# EAGLE design ESP_LoRa_1.2 (EAGLE 9.6.2)
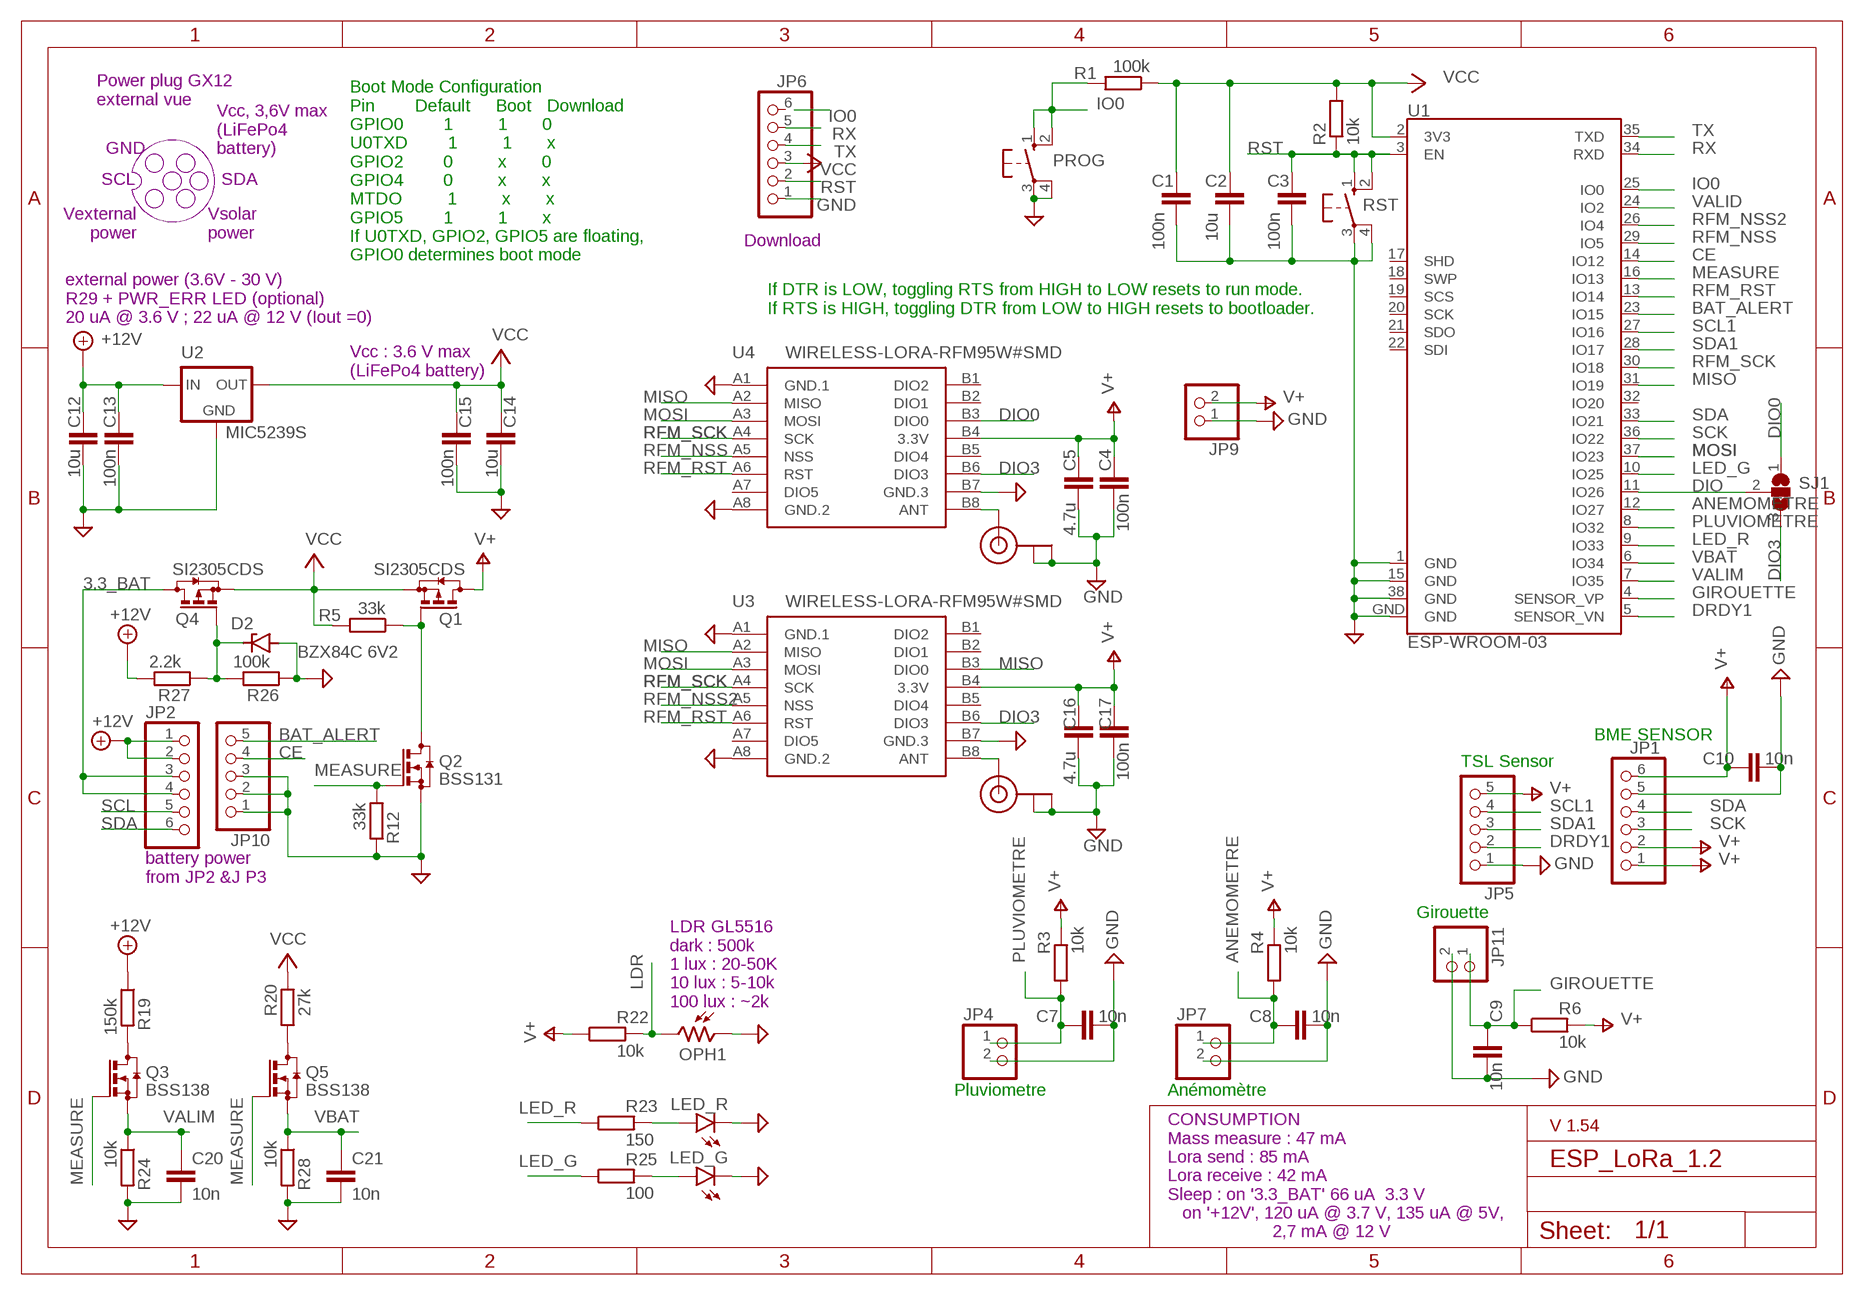
[diagram p0: schematic, sheet 1]

## Parts
C1  100n  CC1206  [C1206]
C2  10u  CC1210  [C1210]
C3  100n  CC1206  [C1206]
C4  100n  CC1206  [C1206]
C5  4.7u  CC1210  [C1210]
C7  10n  CC1206  [C1206]
C8  10n  CC1206  [C1206]
C9  10n  CC1206  [C1206]
C10  10n  CC1206  [C1206]
C12  10u  CC1210  [C1210]
C13  100n  CC1206  [C1206]
C14  10u  CC1210  [C1210]
C15  100n  CC1206  [C1206]
C16  4.7u  CC1210  [C1210]
C17  100n  CC1206  [C1206]
C20  10n  CC1206  [C1206]
C21  10n  CC1206  [C1206]
D2  BZX84C 6V2  BZX84CSMD  [TO236]
J1  U.FL  [U.FL]
J2  U.FL  [U.FL]
JP1  PINHD-1X6  [1X06]
JP2  PINHD-1X6  [1X06]
JP4  PINHD-1X2  [1X02]
JP5  PINHD-1X5  [1X05]
JP6  PINHD-1X6  [1X06]
JP7  PINHD-1X2  [1X02]
JP9  PINHD-1X2  [1X02]
JP10  PINHD-1X5  [1X05]
JP11  PINHD-1X2  [1X02]
LED_G  LEDSMT1206  [1206]
LED_R  LEDSMT1206  [1206]
OPH1  VT93N2  [VT900]
PROG  10-XX  [B3F-10XX]
Q1  SI2305CDS  [SOT23]
Q2  BSS131  [SOT23]
Q3  BSS138  [SOT23]
Q4  SI2305CDS  [SOT23]
Q5  BSS138  [SOT23]
R1  100k  RR1206  [R1206]
R2  10k  RR1206  [R1206]
R3  10k  RR1206  [R1206]
R4  10k  RR1206  [R1206]
R5  33k  RR1206  [R1206]
R6  10k  RR1206  [R1206]
R12  33k  RR1206  [R1206]
R19  150k  RR1206  [R1206]
R20  27k  RR1206  [R1206]
R22  10k  RR1206  [R1206]
R23  150  RR1206  [R1206]
R24  10k  RR1206  [R1206]
R25  100  RR1206  [R1206]
R26  100k  RR1206  [R1206]
R27  2.2k  RR1206  [R1206]
R28  10k  RR1206  [R1206]
RST  10-XX  [B3F-10XX]
SJ1  SJ2W  [SJ_2]
U1  ESP-WROOM-03  [ESP-WROOM-03]
U2  MIC5239S  [SOT223]
U3  WIRELESS-LORA-RFM95W#SMD  [WIRELESS-LORA-RFM95W#SMD]
U4  WIRELESS-LORA-RFM95W#SMD  [WIRELESS-LORA-RFM95W#SMD]

## Nets
3.3_BAT: JP2.3 JP2.4 Q4.3(D)
+12V: C12.1 C13.1 JP2.1 JP2.2 R19.1 R27.2 U2.1(IN)
ANEMOMETRE: C8.1 JP7.1 R4.1 U1.12(IO27)
ANT2: J2.3(SIGNAL) U4.B8(ANT)
ANT3: J1.3(SIGNAL) U3.B8(ANT)
BAT_ALERT: JP10.5 U1.23(IO15)
CE: JP10.4 U1.14(IO12)
DIO: SJ1.2 U1.11(IO26)
DIO0: SJ1.1 U4.B3(DIO0)
DIO3: SJ1.3 U3.B6(DIO3) U4.B6(DIO3)
DRDY1: JP5.2 U1.5(SENSOR_VN)
GIROUETTE: C9.1 JP11.1 R6.1 U1.4(SENSOR_VP)
GND: C1.2 C2.2 C3.2 C4.2 C5.2 C7.2 C8.2 C9.2 C10.2 C12.2 C13.2 C14.2 C15.2 C16.2 C17.2 C20.2 C21.2 D2.A J1.1(GND) J1.2(GND) J2.1(GND) J2.2(GND) JP1.5 JP4.2 JP5.1 JP6.1 JP7.2 JP9.1 JP10.1 JP10.2 JP10.3 JP11.2 LED_G.C LED_R.C OPH1.1 PROG.3(P) PROG.4(P1) Q2.2(S) R12.2 R24.2 R26.1 R28.2 RST.3(P) RST.4(P1) U1.1(GND) U1.15(GND) U1.38(GND) U1.GND U2.2(GND) U2.4(GND) U3.A1(GND.1) U3.A8(GND.2) U3.B7(GND.3) U4.A1(GND.1) U4.A8(GND.2) U4.B7(GND.3)
IO0: PROG.1(S) PROG.2(S1) R1.2 U1.25(IO0)
LDR: OPH1.2 R22.2
LED_G: R25.1 U1.10(IO25)
LED_R: R23.1 U1.9(IO33)
MEASURE: Q2.1(G) Q3.1(G) Q5.1(G) R12.1 U1.16(IO13)
MISO: U1.31(IO19) U3.A2(MISO) U3.B3(DIO0) U4.A2(MISO)
MOSI: U1.37(IO23) U3.A3(MOSI) U4.A3(MOSI)
N$1: Q1.1(G) Q2.3(D) R5.1
N$2: Q3.3(D) R19.2
N$5: Q5.3(D) R20.1
N$7: LED_R.A R23.2
N$8: LED_G.A R25.2
N$35: D2.C Q4.1(G) R26.2 R27.1
PLUVIOMETRE: C7.1 JP4.1 R3.1 U1.8(IO32)
RFM_NSS: U1.29(IO5) U4.A5(NSS)
RFM_NSS2: U1.26(IO4) U3.A5(NSS)
RFM_RST: U1.13(IO14) U3.A6(RST) U4.A6(RST)
RFM_SCK: U1.30(IO18) U3.A4(SCK) U4.A4(SCK)
RST: C3.1 JP6.2 R2.1 RST.1(S) RST.2(S1) U1.3(EN)
RX: JP6.5 U1.34(RXD)
SCK: JP1.3 U1.36(IO22)
SCL: JP2.5
SCL1: JP5.4 U1.27(IO16)
SDA: JP1.4 JP2.6 U1.33(IO21)
SDA1: JP5.3 U1.28(IO17)
TX: JP6.4 U1.35(TXD)
V+: C4.1 C5.1 C10.1 C16.1 C17.1 JP1.1 JP1.2 JP1.6 JP5.5 JP9.2 Q1.3(D) R3.2 R4.2 R6.2 R22.1 U3.B4(3.3V) U4.B4(3.3V)
VALID: U1.24(IO2)
VALIM: C20.1 Q3.2(S) R24.1 U1.7(IO35)
VBAT: C21.1 Q5.2(S) R28.1 U1.6(IO34)
VCC: C1.1 C2.1 C14.1 C15.1 JP6.3 Q1.2(S) Q4.2(S) R1.1 R2.2 R5.2 R20.2 U1.2(3V3) U2.3(OUT)
Unconnected: JP6.6 U1.17(SHD) U1.18(SWP) U1.19(SCS) U1.20(SCK) U1.21(SDO) U1.22(SDI) U1.32(IO20) U3.A7(DIO5) U3.B1(DIO2) U3.B2(DIO1) U3.B5(DIO4) U4.A7(DIO5) U4.B1(DIO2) U4.B2(DIO1) U4.B5(DIO4)

## Notes on the sheet
- Power plug GX12
  external vue
- GND
- Vcc, 3,6V max
  (LiFePo4
  battery)
- SCL | SDA
- Download
- Vexternal
  power
- Vsolar 
  power
- Boot Mode Configuration
  Pin        Default     Boot   Download
  GPIO0        1         1       0
  U0TXD        1         1       x
  GPIO2        0         x       0
  GPIO4        0         x       x
  MTDO         1         x       x
  GPIO5        1         1       x
  If U0TXD, GPIO2, GPIO5 are floating, 
  GPIO0 determines boot mode
- If DTR is LOW, toggling RTS from HIGH to LOW resets to run mode.
  If RTS is HIGH, toggling DTR from LOW to HIGH resets to bootloader.
- external power (3.6V - 30 V)
  R29 + PWR_ERR LED (optional)
  20 uA @ 3.6 V ; 22 uA @ 12 V (Iout =0)
- Vcc : 3.6 V max 
  (LiFePo4 battery)
- BME SENSOR
- TSL Sensor
- battery power
  from JP2 &J P3
- Girouette
- LDR GL5516
  dark : 500k
  1 lux : 20-50K
  10 lux : 5-10k
  100 lux : ~2k
- Pluviometre | Anémomètre
- V 1.54
- CONSUMPTION
  Mass measure : 47 mA
  Lora send : 85 mA
  Lora receive : 42 mA
  Sleep : on '3.3_BAT' 66 uA  3.3 V
     on '+12V', 120 uA @ 3.7 V, 135 uA @ 5V,
                       2,7 mA @ 12 V

## Library data of the parts
C1-C5 C7-C10 C12-C17 C20 C21 = eagle-ltspice:C: CAPACITOR, European symbol; SPICEMODEL: NONE; SPICEPREFIX: C
D2 = diode:BZX84CSMD: Z DIODE
J1 J2 = microbuilder:U.FL: U.FL Antenna Connector
JP1 JP2 JP6 = pinhead:PINHD-1X6: PIN HEADER
JP4 JP7 JP9 JP11 = pinhead:PINHD-1X2: PIN HEADER
JP5 JP10 = pinhead:PINHD-1X5: PIN HEADER
LED_G LED_R = led:LED: LED OSRAM: - CHIPLED LG R971, LG N971, LY N971, LG Q971, LY Q971, LO R971, LY R971 LH N974, LH R974 LS Q976, LO Q976, LY Q976 LO Q996 - Hyper CHIPLED LW Q18S LB Q993, LB Q99A, LB R99A - SideLED LS A670, LO A670, LY A670, LG A670, LP A670 LB A673, LV A673, LT A673, LW A673 LH A674 LY A675 LS A676, LA A676, LO A676, LY A676, LW A676 LS A679, LY A679, LG A679 - Hyper Micro SIDELED® LS Y876, LA Y876, LO Y876, LY Y876 LT Y87S - SmartLED LW L88C, LW L88S LB L89C, LB L89S, LG L890 LS L89K, LO L89K, LY L89K LS L896, LA L896, LO L896, LY L896 - TOPLED LS T670, LO T670, LY T670, LG T670, LP T670 LSG T670, LSP T670, LSY T670, LOP T670, LYG T670 LG T671, LOG T671, LSG T671 LB T673, LV T673, LT T673, LW T673 LH T674 LS T676, LA T676, LO T676, LY T676, LB T676, LH T676, LSB T676, LW T676 LB T67C, LV T67C, LT T67C, LS T67K, LO T67K, LY T67K, LW E67C LS E67B, LA E67B, LO E67B, LY E67B, LB E67C, LV E67C, LT E67C LW T67C LS T679, LY T679, LG T679 LS T770, LO T770, LY T770, LG T770, LP T770 LB T773, LV T773, LT T773, LW T773 LH T774 LS E675, LA E675, LY E675, LS T675 LS T776, LA T776, LO T776, LY T776, LB T776 LHGB T686 LT T68C, LB T68C - Hyper Mini TOPLED® LB M676 - Mini TOPLED Santana® LG M470 LS M47K, LO M47K, LY M47K Source: http://www.osram.convergy.de LUXEON: - LUMILED® LXK2-PW12-R00, LXK2-PW12-S00, LXK2-PW14-U00, LXK2-PW14-V00 LXK2-PM12-R00, LXK2-PM12-S00, LXK2-PM14-U00 LXK2-PE12-Q00, LXK2-PE12-R00, LXK2-PE12-S00, LXK2-PE14-T00, LXK2-PE14-U00 LXK2-PB12-K00, LXK2-PB12-L00, LXK2-PB12-M00, LXK2-PB14-N00, LXK2-PB14-P00, LXK2-PB14-Q00 LXK2-PR12-L00, LXK2-PR12-M00, LXK2-PR14-Q00, LXK2-PR14-R00 LXK2-PD12-Q00, LXK2-PD12-R00, LXK2-PD12-S00 LXK2-PH12-R00, LXK2-PH12-S00 LXK2-PL12-P00, LXK2-PL12-Q00, LXK2-PL12-R00 Source: www.luxeon.com KINGBRIGHT: KA-3528ASYC Source: www.kingbright.com
OPH1 = photo-elements:VT9: Photoconductive Cell VT900 Series Source: http://optoelectronics.perkinelmer.com/content/Datasheets/DTS_vt900seriesdatasheet.pdf
PROG RST = switch-omron:10-XX: OMRON SWITCH; MPN: B3F-1000; OC_FARNELL: 176432; OC_NEWARK: 36M3542
Q1 Q4 = transistor-small-signal-perso:SI2305CDS: P-CHANNEL MOS FET
Q2 = transistor-small-signal-perso:BSS131: N-CHANNEL MOS FET
Q3 Q5 = detect:BSS138: N-CHANNEL MOS FET
R1-R6 R12 R19 R20 R22-R28 = eagle-ltspice:R: RESISTOR, European symbol; SPICEMODEL: NONE; SPICEPREFIX: R
SJ1 = jumper:SJ2W: SMD solder JUMPER
U1 = esp32-sparkfun (1):ESP-WROOM-03; OC_FARNELL: unknown
U2 = micrel:MIC5239S: LDO REGULATOR
U3 U4 = diy-modules:WIRELESS-LORA-RFM95W: 868/915 MHz LoRa Radio Transceiver Module based on SX1276 chip Click here to find device on ebay.com <http://www.ebay.com/sch/RFM95W+transceiver>

## Board
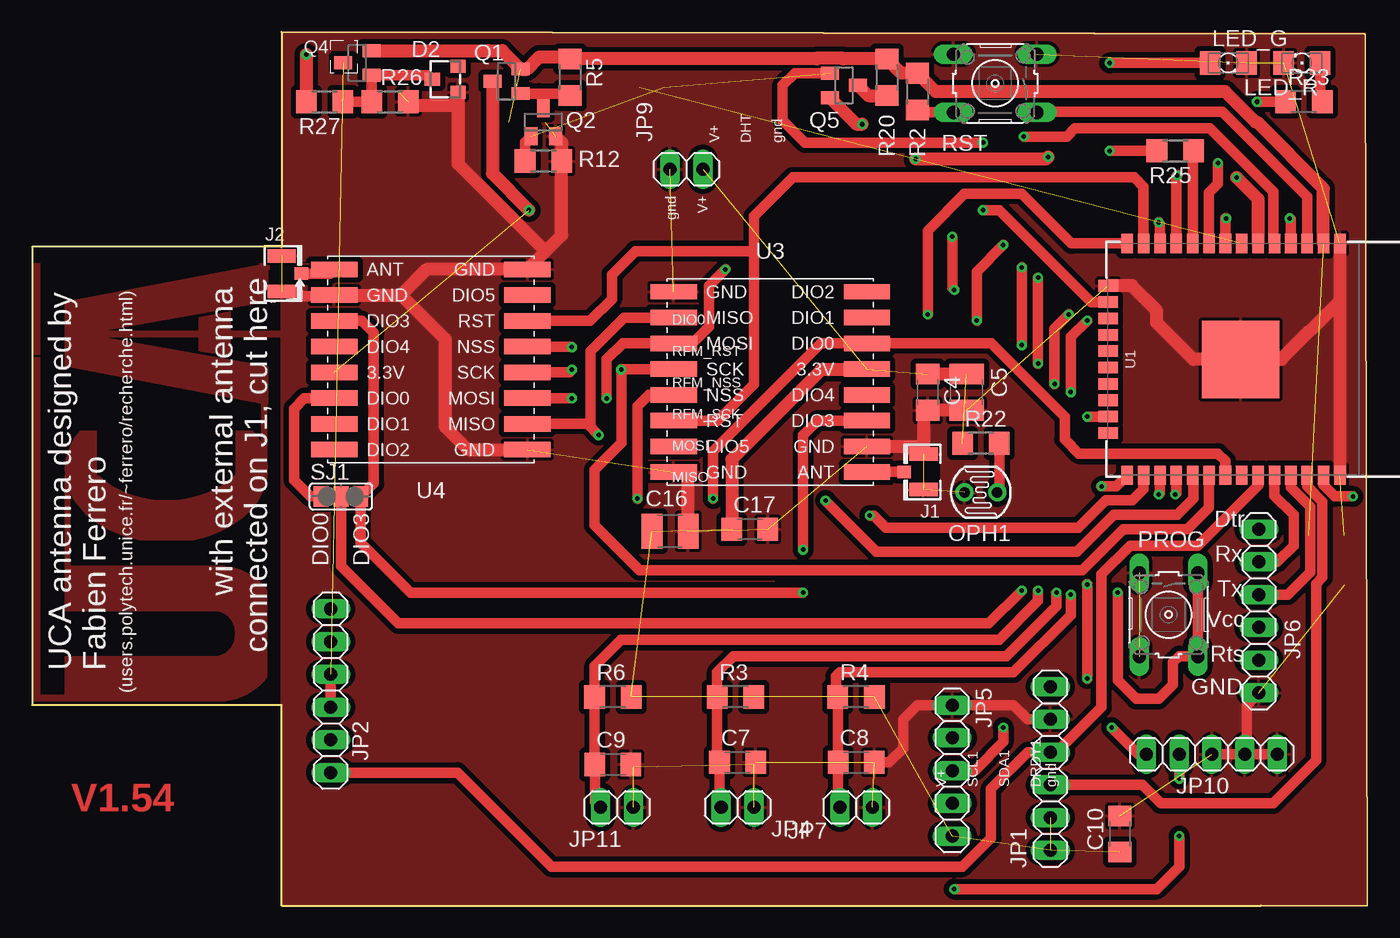
[diagram p1: board, top side]
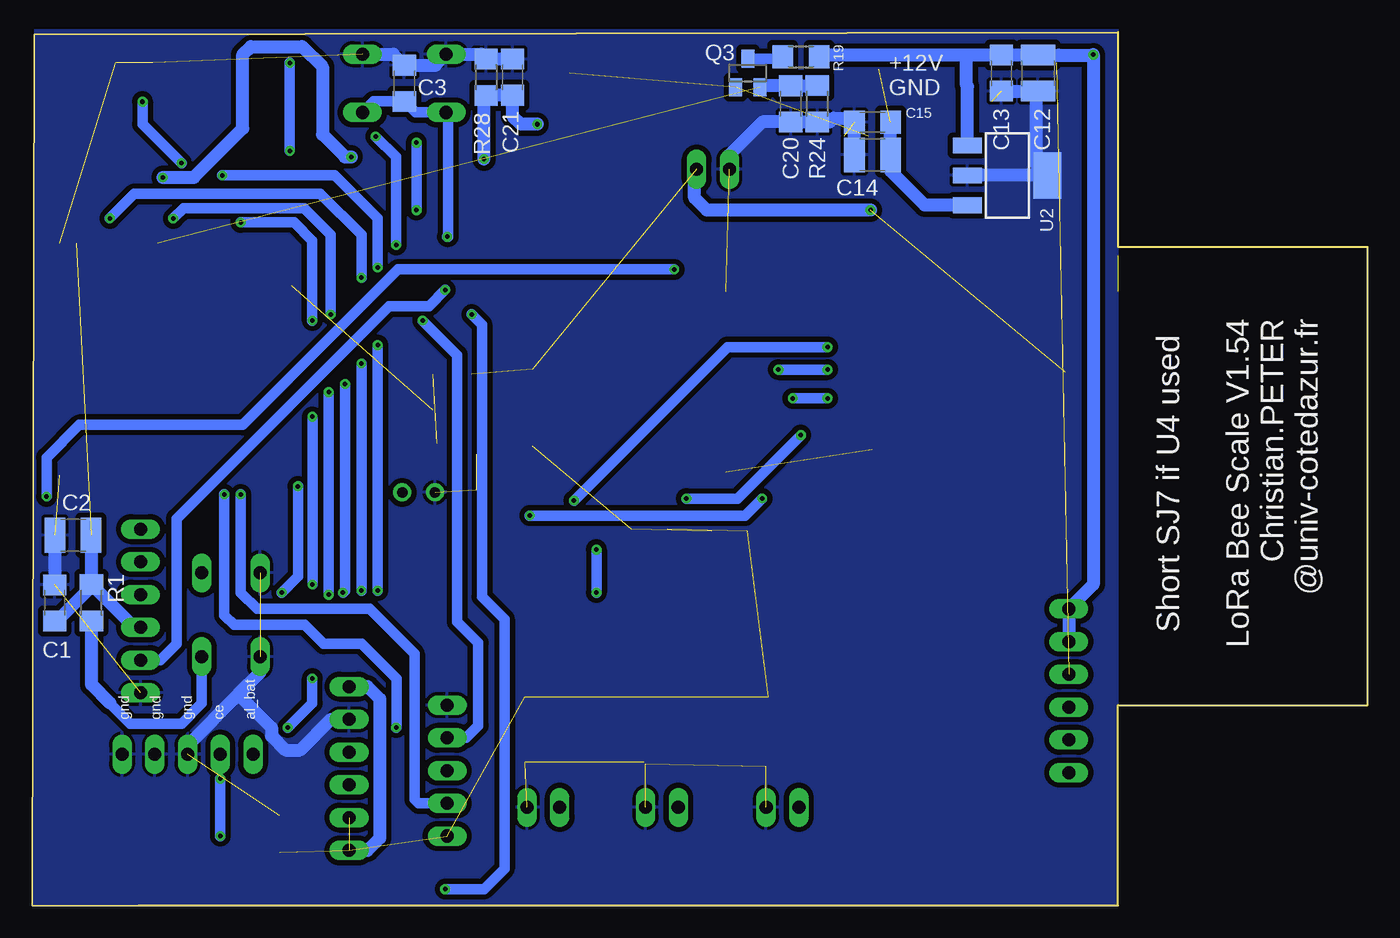
[diagram p2: board, bottom side, seen from below]

Size 103.66 x 67.79 mm. Coordinates in mm from the lower left corner, seen from the top.
Outline: 19.37,0 19.37,15.56 0,15.56 0,51.12 19.37,51.12 19.37,67.79 103.51,67.63 103.66,0 95.41,0 19.37,0
Copper layers (1*16): Top 0.035mm / dielectric 1.5mm / Bottom 0.035mm
Design rules "default *": minimum track width 6mil, minimum drill 0.35mm, track to track 6mil, track to pad 6mil, pad to pad 6mil, via to via 6mil, smd to smd 6mil, copper to edge 0mil, drill to drill 6mil, minimum pad ring 10mil, minimum via ring 8mil, stop-mask expansion 4mil, vias tented up to drill 0mil, thermal gap 10mil

### Footprints (pad centres in the part's own frame; a part is rotated, then mirrored left to right if it is on the bottom)
C1206 = smd 1.6 x 1.8: 1 -1.4,0; 2 1.4,0
C1210 = smd 1.6 x 2.7: 1 -1.4,0; 2 1.4,0
TO236 = smd 1 x 1.2: A -1,-1; C 0,1; NC 1,-1
U.FL = smd 2.2 x 1.05: 1 0,1.375; 2 0,-1.375 | smd 1.05 x 1: 3 1.525,0
1X06 = drill 1.016 long: 1 -6.35,0; 2 -3.81,0; 3 -1.27,0; 4 1.27,0; 5 3.81,0; 6 6.35,0
1X02 = drill 1.016 long: 1 -1.27,0; 2 1.27,0
1X05 = drill 1.016 long: 1 -5.08,0; 2 -2.54,0; 3 0,0; 4 2.54,0; 5 5.08,0
1206 = smd 1.6 x 1.803: A -1.422,0; C 1.422,0
VT900 = drill 0.8 pad 1.4: 1 -1.27,0; 2 1.27,0
B3F-10XX = drill 1.016 long: 1 -3.251,2.261; 2 3.251,2.261; 3 -3.251,-2.261; 4 3.251,-2.261
SOT23 = smd 1 x 1.4: 1 -0.95,-1.1; 2 0.95,-1.1; 3 0,1.1
R1206 = smd 1.6 x 1.803: 1 -1.422,0; 2 1.422,0
SJ_2 = smd 1.168 x 1.6: 1 -1.524,0; 2 0,0; 3 1.524,0
ESP-WROOM-03 = smd 0.9 x 1.5: 1 7.7,9; 2 6.43,9; 3 5.16,9; 4 3.89,9; 5 2.62,9; 6 1.35,9; 7 0.08,9; 8 -1.19,9; 9 -2.46,9; 10 -3.73,9; 11 -5,9; 12 -6.27,9; 13 -7.54,9; 14 -8.81,9; 25 -8.81,-9; 26 -7.54,-9; 27 -6.27,-9; 28 -5,-9; 29 -3.73,-9; 30 -2.46,-9; 31 -1.19,-9; 32 0.08,-9; 33 1.35,-9; 34 2.62,-9; 35 3.89,-9; 36 5.16,-9; 37 6.43,-9; 38 7.7,-9 | smd 1.5 x 0.9: 15 -10.3,5.715; 16 -10.3,4.445; 17 -10.3,3.175; 18 -10.3,1.905; 19 -10.3,0.635; 20 -10.3,-0.635; 21 -10.3,-1.905; 22 -10.3,-3.175; 23 -10.3,-4.445; 24 -10.3,-5.715 | smd 6 x 6: GND 0,0
SOT223 = smd 1.219 x 2.235: 1 -2.311,-3.099; 2 0,-3.099; 3 2.311,-3.099 | smd 3.6 x 2.2: 4 0,3.099
WIRELESS-LORA-RFM95W#SMD = smd 3.6 x 1.2: A1 -7.5,7; A2 -7.5,5; A3 -7.5,3; A4 -7.5,1; A5 -7.5,-1; A6 -7.5,-3; A7 -7.5,-5; A8 -7.5,-7; B1 7.5,7; B2 7.5,5; B3 7.5,3; B4 7.5,1; B5 7.5,-1; B6 7.5,-3; B7 7.5,-5; B8 7.5,-7

### Placement (x,y rotation side)
C1  101.92,23.49 90 bottom
C2  100.49,28.73 180 bottom
C3  74.77,63.82 90 bottom
C4  69.53,39.85 270 top
C5  72.55,39.85 270 top
C7  54.77,11.11 0 top
C8  63.98,11.11 0 top
C9  45.09,10.95 0 top
C10  84.45,5.56 90 top
C12  25.56,64.61 270 bottom
C13  28.42,64.61 270 bottom
C14  38.42,58.26 180 bottom
C15  38.42,60.8 180 bottom
C16  49.53,29.05 0 top
C17  55.72,29.21 0 top
C20  44.77,62.23 270 bottom
C21  66.36,64.29 90 bottom
D2  32.07,64.14 90 top
J1  69.22,33.66 180 top
J2  19.37,49.05 0 top
JP1  79.06,10.64 90 top
JP2  23.18,16.67 270 top
JP4  54.77,7.62 0 top
JP5  71.44,10.48 270 top
JP6  95.25,22.86 90 top
JP7  63.98,7.62 0 top
JP9  50.8,57.15 0 top
JP10  91.6,11.75 180 top
JP11  45.4,7.62 0 top
LED_G  92.87,65.41 0 top
LED_R  98.58,65.41 180 top
OPH1  73.66,32.07 0 top
PROG  88.23,22.57 270 top
Q1  36.83,63.98 90 top
Q2  39.69,60.8 0 top
Q3  48.1,64.61 0 bottom
Q4  25.24,65.41 90 top
Q5  63.02,63.66 270 top
R1  99.06,23.49 270 bottom
R2  68.74,63.18 90 top
R3  54.61,16.19 0 top
R4  63.98,16.19 0 top
R5  41.75,64.29 90 top
R6  45.09,16.19 0 top
R12  39.69,57.79 0 top
R19  43.97,65.88 180 bottom
R20  66.36,64.29 90 top
R22  73.66,35.88 0 top
R23  98.74,62.39 0 top
R24  42.7,62.23 270 bottom
R25  88.74,58.58 180 top
R26  27.78,62.39 180 top
R27  22.7,62.39 180 top
R28  68.42,64.29 90 bottom
RST  74.77,63.82 180 top
SJ1  23.97,31.75 0 top
U1  93.83,42.39 0 top
U2  27.94,56.67 270 bottom
U3  57.31,40.64 0 top
U4  30.96,42.39 180 top

### Tracks (layer width: path | path; a pad name or v marks a point on that pad's centre or on a via)
3.3_BAT  (1 unrouted)
  Top 0.813: JP2.4 JP2.3
+12V  (via drill 0.35)
  Top 1.016: v21.27,66.04 R27.2
  Bottom 1.016: 30.96,66.01 C13.1 C12.1 23.97,66.01 21.27,66.01 v21.27,66.04 21.27,24.92 JP2.1 JP2.2 | 30.96,66.01 42.42,66.01 R19.1 | U2.1 31.04,63.58 31.12,63.66 31.12,65.85 30.96,66.01
ANEMOMETRE  (via drill 0.35)
  Top 0.813: JP7.1 62.58,7.75 C8.1 62.55,11.13 R4.1 62.39,16.36 62.39,17.78 62.71,18.1 76.2,18.1 80.65,22.54 v80.65,24.13 | v81.92,45.4 80.65,44.13 v80.65,39.85 | v87.47,53.02 87.56,52.93 U1.12
  Bottom 0.813: v80.65,39.85 v80.65,24.13 | v81.92,45.4 81.92,46.83 81.92,51.59 83.34,53.02 v87.47,53.02
ANT
  pour Top: 14.99,15.86 0.14,15.86 0.14,42.56 0.64,42.56 0.64,16.36 2.54,16.36 2.54,19.36 14.19,19.36 14.32,19.37 14.46,19.39 14.59,19.42 14.73,19.47 14.85,19.53 14.97,19.59 15.09,19.68 15.2,19.77 15.3,19.87 15.39,19.99 15.48,20.11 15.55,20.23 15.61,20.37 15.67,20.51 15.71,20.66 15.74,20.81 15.76,20.96 15.76,21.11 15.76,21.26 15.74,21.41 15.71,21.56 15.67,21.71 15.61,21.85 15.55,21.98 15.48,22.11 15.39,22.23 15.3,22.35 15.2,22.45 15.09,22.54 14.97,22.63 14.85,22.7 14.73,22.75 14.59,22.8 14.46,22.83 14.32,22.85 14.19,22.86 2.54,22.86 2.54,33.36 2.57,33.36 2.55,33.97 2.61,34.58 2.75,35.18 2.99,35.78 3.31,36.35 3.72,36.86 5.03,36.86 5.03,33.36 5.17,33.36 5.5,33.07 5.85,32.8 6.22,32.56 6.63,32.33 7.06,32.13 7.5,31.96 7.96,31.8 8.44,31.68 8.92,31.58 9.42,31.51 9.92,31.47 10.42,31.46 10.92,31.47 11.42,31.51 11.92,31.58 12.41,31.68 12.88,31.8 13.35,31.96 13.78,32.13 14.21,32.33 14.62,32.56 14.99,32.8 15.34,33.07 15.67,33.36 15.82,33.36 15.82,36.86 17.13,36.86 17.25,36.71 17.37,36.55 17.49,36.39 17.59,36.23 17.69,36.06 17.79,35.9 17.79,38.96 2.54,41.86 2.54,46.86 17.64,49.73 17.64,49.86 20.14,49.86 20.14,49.85 20.64,49.85 20.64,49.37 20.76,49.37 20.76,49.85 22.54,49.85 22.54,48.84 20.77,48.84 20.77,49.32 20.64,49.32 20.64,48.84 19.99,48.84 19.99,49.36 18.31,49.36 18.31,46.86 5.61,44.61 12.91,44.61 12.91,45.66 15.4,46.11 15.4,44.61 19.99,44.61 19.99,44.86 20.39,44.86 20.39,43.86 19.99,43.86 19.99,44.11 15.4,44.11 15.4,42.61 14.21,42.83 13.08,43 13.08,43.03 12.91,43.06 12.91,44.11 5.61,44.11 18.31,41.86 18.31,38.86 18.24,38.87 18.24,34.62 18.3,34.08 18.29,33.53 18.21,32.98 18.06,32.44 17.83,31.92 17.55,31.42 17.18,30.93 16.76,30.47 16.3,30.06 15.76,29.66 15.17,29.31 14.57,29.01 13.89,28.74 13.2,28.52 12.49,28.36 8.35,28.36 7.75,28.49 7.15,28.67 6.57,28.89 6.03,29.12 5.51,29.4 5.02,29.71 4.58,30.03 4.16,30.39 3.79,30.78 3.47,31.17 3.19,31.59 2.95,32.04 2.95,26.36 14.99,26.36 14.99,26.35 15.4,26.29 15.81,26.2 16.21,26.06 16.59,25.89 16.96,25.68 17.31,25.44 17.65,25.16 17.96,24.85 18.24,24.51 18.24,17.71 17.96,17.37 17.65,17.06 17.31,16.78 16.96,16.54 16.59,16.33 16.21,16.16 15.81,16.03 15.4,15.93 14.99,15.87
ANT1
  pour Top: 0.64,42.76 0.14,42.76 0.14,49.86 0.64,49.86
ANT2
  Top 0.813: U4.B8 23.12,49.05 J2.3
ANT3
  Top 0.813: U3.B8 64.82,33.65 J1.3
BAT_ALERT  (via drill 0.35)
  Top 0.813: JP10.5 85.88,11.75 v83.82,13.81 | v81.92,17.62 81.92,24.94 v81.9,24.92 | U1.23 v81.92,37.94
  Bottom 0.813: v83.82,13.81 81.92,15.72 v81.92,17.62 | v81.9,24.92 81.9,37.78
CE  (via drill 0.35)
  Top 0.813: U1.14 80.69,51.39 76.84,55.25 72.39,55.25 69.53,52.39 v69.53,45.88 | v71.6,1.27 87.31,1.27 89.06,3.02 v89.06,5.4 | v89.06,9.84 JP10.4
  Bottom 0.813: v69.53,45.88 68.74,45.08 68.74,23.97 66.99,22.22 66.99,2.86 68.58,1.27 v71.6,1.27 | v89.06,9.84 v89.06,5.4
DIO  (via drill 0.35)
  Top 0.813: SJ1.2 23.97,26.35 28.42,21.91 74.3,21.91 v76.84,24.45 | v88.9,56.67 88.83,56.61 U1.11 | v76.84,49.53 v76.84,43.5
  Bottom 0.813: v88.9,56.67 80.17,56.67 76.84,53.34 v76.84,49.53 | v76.84,43.5 v76.84,24.45
DIO0
  Top 0.813: SJ1.1 21.59,31.75 20.32,33.02 20.32,38.58 21.13,39.39 U4.B3
DIO3  (via drill 0.35)
  Top 0.813: U4.B6 25.58,45.39 26.51,44.45 26.51,32.77 SJ1.3 25.5,28.16 29.37,24.29 v59.85,24.29 | U3.B6 60.98,37.64 59.85,36.51 v59.85,27.62
  Bottom 0.813: v59.85,27.62 v59.85,24.29
DRDY1  (via drill 0.35)
  Top 0.813: U1.5 96.36,51.48 96.36,55.4 91.44,60.33 80.96,60.33 80.33,59.69 v76.99,59.69 | v75.41,51.28 73.34,49.21 v73.34,45.4
  Bottom 0.813: v76.99,59.69 75.41,58.1 v75.41,51.28 | v73.34,45.4 70.66,42.71 70.66,22.01 69.04,20.39 69.04,13.97 69.99,13.02 JP5.2
GIROUETTE  (via drill 0.35)
  Top 0.813: JP11.1 43.69,8.07 C9.1 43.66,10.98 R6.1 43.66,18.58 45.72,20.64 75.09,20.64 78.11,23.65 v78.11,24.45 | v78.11,48.74 v78.11,42.07 | v97.63,53.34 97.72,53.25 U1.4
  Bottom 0.813: v78.11,42.07 78.11,41.91 v78.11,24.45 | v97.63,53.34 95.73,55.25 81.29,55.25 78.11,52.06 v78.11,48.74
GND  (22 unrouted)
  Top 0.813: J2.2 20.58,47.68 20.96,47.31 23.38,47.31 U4.B7 | JP6.1 94.3,15.56 94.3,11.91 JP10.2 | JP10.2 JP10.1 | JP10.2 JP10.3 | JP1.5 77.31,14.45 76.2,15.56 JP5.1 68.74,15.56 67.63,14.45 67.63,12.22 66.52,11.11 C8.2 | 56.04,10.98 C7.2 | C9.2 46.67,10.77
  Top 1.016: C16.2 50.93,33.47 50.96,33.5 50.82,33.64 U3.A8 | Q2.2 41.11,59.23 R12.2 41.11,52.04 39.86,50.79 | R26.1 29.52,62.07 33.07,62.07 D2.A 33.07,57.58 39.86,50.79 | U4.B7 28.66,47.39 | U4.A1 33.83,35.39 32.07,37.15 32.07,43.97 28.66,47.39 | 28.66,47.39 30.64,49.37 38.44,49.37 U4.A8 39.86,50.79 | U1.1 101.53,46.92 | 101.53,46.92 97,42.39 U1.GND 90.16,42.39 87.31,45.24 87.31,46.2 85.4,48.11 U1.15 | 101.53,46.92 U1.38 | C5.2 C4.2 69.22,38.13 69.22,35.56 | 69.22,35.56 J1.2 | U3.B7 69.14,35.64 69.22,35.56
  Bottom 1.016: JP9.1 49.53,58.26 46.96,60.83 C20.2 44.75,60.81 R24.2 41.74,60.81 41.43,61.12 40.14,61.12 C15.2 C14.2 | U2.2 U2.4 25.72,57.55 25.72,63.05 C12.2 C13.2 | C21.2 66.38,65.72 R28.2 68.78,66.08 RST.4 72.38,65.22 C3.2 75.63,66.08 RST.3 | C2.2 101.89,24.92 C1.2 | 87.67,16.39 91.6,12.46 JP10.3 | 87.67,16.39 85.97,18.09 PROG.4 | 87.67,16.39 85.09,13.81 85.09,13.18 83.98,12.06 82.87,12.06 80.49,14.45 JP1.5
  pour Top (isolate 0.406): 19.37,0 19.37,50.96 19.42,50.96 19.42,67.73 103.45,67.73 103.55,31.09 103.55,0
  pour Bottom (isolate 0.406): 19.37,0 19.37,67.95 103.47,67.95 103.65,0.08 103.69,0.12 103.66,0
IO0  (via drill 0.35)
  Top 0.813: PROG.1 PROG.2 90.45,19.37 89.06,19.37 88.58,18.89 88.58,17.14 87.47,16.03 85.73,16.03 84.28,17.48 v84.28,24.29 | U1.25 84.17,32.54 v83.03,32.54
  Bottom 0.813: 97.63,15.72 96.04,14.13 92.08,14.13 90.49,15.71 PROG.2 | v84.28,24.29 83.03,25.54 v83.03,32.54
  Bottom 1.016: 97.63,15.72 99.06,17.14 R1.2
LDR
  Top 0.813: R22.2 75.08,32.22 OPH1.2
LED_G
  Top 0.813: R25.1 90.1,58.52 U1.10
LED_R  (via drill 0.35)
  Top 0.813: R23.1 v95.09,62.39 | v92.08,57.63 92.08,56.04 91.37,55.33 U1.9
  Bottom 0.813: v95.09,62.39 95.09,60.64 v92.08,57.63
MEASURE  (via drill 0.35)  (2 unrouted)
  Top 0.813: U1.16 82.23,46.84 75.09,53.97 v73.82,53.97 | v73.82,59.21 60.01,59.21 58.26,60.96 58.26,63.66 59.21,64.61 Q5.1 | Q2.1 38.27,59.23 R12.1
  Bottom 0.813: v73.82,53.97 v73.82,59.21
MISO  (via drill 0.35)
  Top 0.813: U3.A2 45.96,45.64 43.34,43.02 43.34,37.47 43.26,37.39 43.1,37.39 | 43.1,37.39 U4.A2 | v52.86,31.59 52.86,35.24 61.26,43.64 U3.B3 74.47,43.64 80.17,37.94 80.17,36.19 81.28,35.08 92.08,35.08 92.64,34.52 U1.31 | v43.97,36.51 43.1,37.39
  Bottom 0.813: v52.86,31.59 48.9,31.59 v43.97,36.51
MOSI  (via drill 0.35)
  Top 0.813: v44.61,39.37 44.61,42.39 45.86,43.64 U3.A3 51.26,43.64 52.55,44.93 52.55,48.1 v53.82,49.37 | v41.91,39.37 38.47,39.37 U4.A3 | U1.37 100.26,32.64 101.16,31.75 v102.55,31.75
  Bottom 0.813: v44.61,39.37 v41.91,39.37 | v53.82,49.37 75.25,49.37 87.31,37.31 100.01,37.31 102.55,34.77 v102.55,31.75
N$1
  Top 0.813: Q1.1 39.37,63.03 | Q2.3 39.69,62.71 39.37,63.03 | 39.37,63.03 41.6,63.03 R5.1
N$2
  Bottom 0.813: Q3.3 45.57,65.71 R19.2
N$5
  Top 1.016: Q5.3 64.91,62.87 R20.1
N$7
  Top 0.813: LED_R.A 100.01,62.55 R23.2
N$8  (via drill 0.35)
  Top 0.813: LED_G.A v83.66,65.4 | R25.2 v83.66,58.58
  Bottom 0.813: v83.66,65.4 v83.66,58.58
N$35
  Top 0.813: R27.1 R26.2 26.36,64.44 Q4.1 30.75,64.45 D2.C
PLUVIOMETRE  (via drill 0.35)
  Top 0.813: JP4.1 53.37,7.75 C7.1 53.19,11.29 R3.1 53.19,18.09 53.18,18.1 54.44,19.35 75.65,19.35 79.53,23.24 v79.53,24.29 | v80.49,45.88 79.38,44.77 v79.38,40.48 | U1.8 92.64,53.33 v92.71,53.33
  Bottom 0.813: v79.38,40.48 79.38,24.45 v79.53,24.29 | v80.49,45.88 80.49,52.07 82.54,54.12 91.92,54.12 v92.71,53.33
RFM_NSS  (via drill 0.35)
  Top 0.813: U4.A5 41.86,43.39 v41.91,43.34 | v61.6,31.43 65.56,27.46 81.12,27.46 83.98,30.32 88.9,30.32 90.17,31.59 90.17,33.33 U1.29
  Bottom 0.813: v41.91,43.34 49.69,43.34 v61.6,31.43
RFM_NSS2  (via drill 0.35)
  Top 0.813: U3.A5 47.9,39.64 46.99,38.73 v46.99,31.59 | v65.04,30.27 65.35,30.27 66.31,29.32 81.23,29.32 83.36,31.45 85.42,31.45 86.29,32.32 U1.26
  Bottom 0.813: v46.99,31.59 48.31,30.27 v65.04,30.27
RFM_RST
  Top 0.813: U3.A6 53.2,37.64 56.04,40.48 56.04,50.8 | 56.04,50.8 46.83,50.8 45.01,48.97 45.01,47.07 43.32,45.39 U4.A6 | 56.04,50.8 56.04,53.5 59.06,56.51 85.57,56.51 86.29,55.79 U1.13
RFM_SCK  (via drill 0.35)
  Top 0.813: U3.A4 45.77,41.64 | 45.77,41.64 v45.72,41.59 | v41.91,41.59 41.7,41.39 U4.A4 | U1.30 91.37,30.89 89.69,29.21 84.71,29.21 81.52,26.02 57.82,26.02 57.81,26.03 47.15,26.03 43.66,29.53 43.66,33.81 45.77,35.93 45.77,41.64
  Bottom 0.813: v45.72,41.59 v41.91,41.59
RST  (via drill 0.35)
  Top 0.813: R2.1 68.94,61.56 RST.2 | U1.3 98.99,55 92.39,61.59 78.06,61.59 RST.1 | v71.44,51.91 71.44,47.94 v71.6,47.78
  Bottom 0.813: RST.1 77.16,62.42 C3.1 73.91,61.56 RST.2 71.36,61.4 71.36,51.91 v71.44,51.91 | JP6.2 93.73,19.05 92.45,20.33 92.45,30.04 75.97,46.53 72.85,46.53 v71.6,47.78
RX
  Top 0.813: U1.34 96.45,31.82 97.95,30.32 97.95,27.94 96.68,26.67 JP6.5
SCK
  Top 0.813: U1.36 98.99,32.55 100.18,31.36 100.18,25.48 99.7,24.99 99.7,11.27 96.36,7.94 87.63,7.94 86.2,9.37 JP1.3
SCL1  (via drill 0.35)
  Top 0.813: U1.27 87.56,32 v87.47,31.91
  Bottom 0.813: v87.47,31.91 87.47,24.29 86.2,23.02 77.47,23.02 73.98,19.53 73.98,15.96 73.96,15.95 73.96,8.24 73.66,7.94 JP5.4
SDA
  Top 0.813: JP2.6 33.02,10.32 40.32,3.02 72.23,3.02 74.45,5.24 74.45,9.05 77.31,11.91 JP1.4 79.53,11.91 83.03,15.4 83.03,25.72 85.25,27.94 90.49,27.94 95.18,32.63 U1.33
SDA1  (via drill 0.35)
  Top 0.813: U1.28 88.83,32 v88.74,31.91 | v75.41,13.81 75.41,12.7 73.18,10.48 JP5.3
  Bottom 0.813: v75.41,13.81 75.39,13.83 75.39,17.6 78.1,20.31 81.03,20.31 82.51,21.79 87.99,21.79 88.74,22.54 v88.74,31.91
TX
  Top 0.813: U1.35 97.72,32.45 99.22,30.96 99.22,25.88 97.47,24.13 JP6.4
V+  (via drill 0.35)  (12 unrouted)
  Top 1.016: Q1.3 35.73,56.82 v38.58,53.97 | C5.1 C4.1 | U3.B4 64.76,41.59 61.28,41.59 54.32,34.64 C17.1
  Bottom 1.016: JP9.2 52.23,56.99 52.23,54.93 51.28,53.97 v38.58,53.97 | JP1.6 77.63,16.99 76.68,16.03 76.68,5.24 77.63,4.29 JP1.1
VALIM  (1 unrouted)
  Bottom 1.016: R24.1 42.73,63.63 C20.1 47.03,63.63 Q3.2
VBAT  (via drill 0.35)
  Top 1.016: Q5.2 63.99,60.64 v64.45,60.64 | U1.6 95.18,54.84 v93.5,56.51 | v78.9,58.1 78.74,57.94 v68.58,57.94
  Bottom 1.016: v64.45,60.64 65.72,60.64 66.36,61.28 C21.1 68.4,62.89 R28.1 68.58,62.71 v68.58,57.94 | v93.5,56.51 91.12,56.51 87.31,60.33 87.31,66.04 86.68,66.68 82.71,66.68 81.12,65.09 81.12,59.85 79.38,58.1 v78.9,58.1
VCC  (2 unrouted)
  Top 1.016: Q4.2 35.4,66.36 36.5,66.36 Q1.2 38.42,64.93 39.37,65.88 41.59,65.88 R5.2 60.9,65.72 60.95,65.77 62.9,65.77 62.95,65.72 R20.2 67.47,64.6 R2.2 70.16,63.18 92.63,63.18 94.99,60.83 95.07,60.83 100.26,55.63 U1.2
  Bottom 1.016: U2.3 34.36,54.36 37.02,57.02 C14.1 C15.1 | 101.9,22.07 C1.1 101.73,22.1 99.06,24.76 | 99.06,24.76 R1.1 95.73,21.59 JP6.3 | C2.1 99.09,24.79 99.06,24.76

### Text on the board
Top: V1.54
tNames: V+ / / DHT / / gnd | gnd / / V+ | with external antenna / connected on J1, cut here | DIO0 / / RFM_RST / / RFM_NSS / / RFM_SCK / / MOSI / / MISO | Dtr | Rx | DIO0 | DIO3 | Tx | Vcc | Rts | UCA antenna designed by / Fabien Ferrero | GND | (users.polytech.unice.fr/~ferrero/recherche.html) | V+ / / SCL1 / / SDA1 / / DRDY1 / gnd
bNames: +12V / GND | LoRa Bee Scale V1.54 / Christian.PETER / @univ-cotedazur.fr | Short SJ7 if U4 used | gnd / / gnd / / gnd / / ce / / al_bat